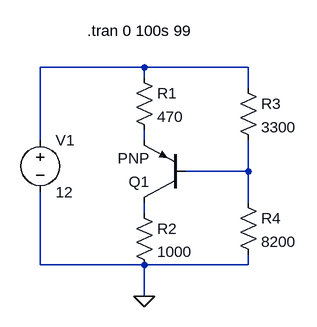
[diagram p0: schematic Exp3_PreLab_P1.asc]
Exp3_PreLab_P1.asc, the LTspice schematic file:
Version 4
SHEET 1 880 680
WIRE 272 -32 112 -32
WIRE 432 -32 272 -32
WIRE 272 -16 272 -32
WIRE 432 0 432 -32
WIRE 112 80 112 -32
WIRE 272 80 272 64
WIRE 432 128 432 80
WIRE 432 128 336 128
WIRE 432 176 432 128
WIRE 272 192 272 176
WIRE 112 272 112 160
WIRE 272 272 112 272
WIRE 432 272 432 256
WIRE 432 272 272 272
WIRE 272 320 272 272
FLAG 272 320 0
SYMBOL pnp 336 176 R180
SYMATTR InstName Q1
SYMBOL res 256 -32 R0
SYMATTR InstName R1
SYMATTR Value 470
SYMBOL res 256 176 R0
SYMATTR InstName R2
SYMATTR Value 1000
SYMBOL res 416 -16 R0
SYMATTR InstName R3
SYMATTR Value 3300
SYMBOL res 416 160 R0
SYMATTR InstName R4
SYMATTR Value 8200
SYMBOL voltage 112 64 R0
SYMATTR InstName V1
SYMATTR Value 12
TEXT 184 -88 Left 2 !.tran 0 100s 99

The netlist it stands for:
* Exp3_PreLab_P1.asc
Q1 N004 N003 N002 0 PNP
R1 N001 N002 470
R2 N004 0 1000
R3 N001 N003 3300
R4 N003 0 8200
V1 N001 0 12
.model NPN NPN
.model PNP PNP
.lib standard.bjt
.tran 0 100s 99
.backanno
.end